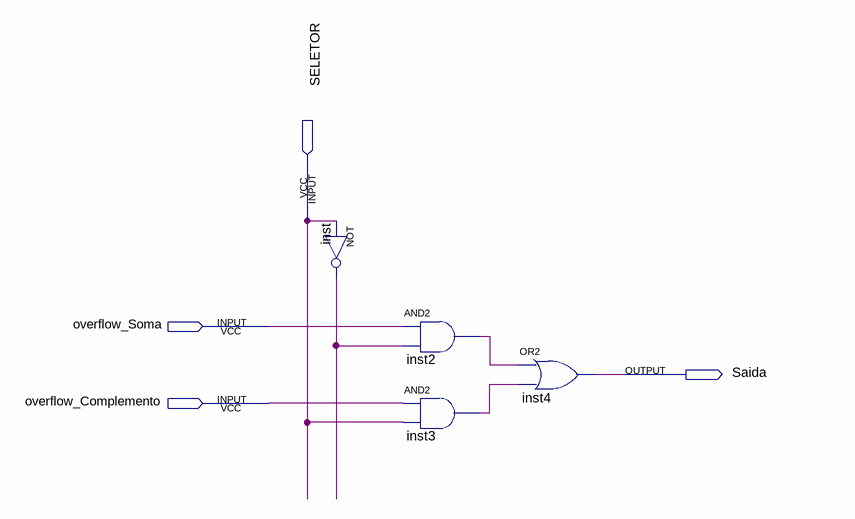
[diagram p0: schematic sheet]
// Quartus schematic Multiplexador_overflow.bdf as structural Verilog: 4 symbols, 4 pins
module Multiplexador_overflow (
  input  SELETOR,
  input  overflow_Soma,
  input  overflow_Complemento,
  output Saida
);

  wire inst2_out, inst3_out, inst_out;

  not inst (inst_out, SELETOR);
  and inst2 (inst2_out, overflow_Soma, inst_out);
  and inst3 (inst3_out, overflow_Complemento, SELETOR);
  or inst4 (Saida, inst2_out, inst3_out);
endmodule
